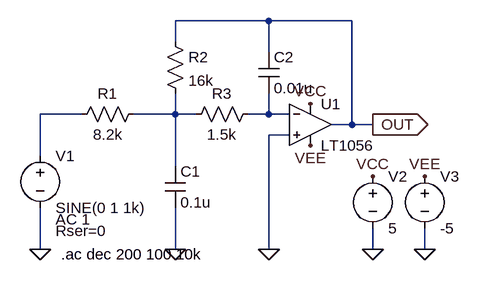
[diagram p0: schematic 2-5_MFB_2nd-Order_LPF.asc]
2-5_MFB_2nd-Order_LPF.asc, the LTspice schematic file:
Version 4.1
SHEET 1 880 680
WIRE 416 -80 272 -80
WIRE 544 -80 416 -80
WIRE 272 -48 272 -80
WIRE 416 -32 416 -80
WIRE 128 64 64 64
WIRE 272 64 272 32
WIRE 272 64 208 64
WIRE 304 64 272 64
WIRE 416 64 416 32
WIRE 416 64 384 64
WIRE 448 64 416 64
WIRE 544 80 544 -80
WIRE 544 80 512 80
WIRE 576 80 544 80
WIRE 448 96 416 96
WIRE 64 128 64 64
WIRE 272 144 272 64
WIRE 64 272 64 208
WIRE 272 272 272 208
WIRE 416 272 416 96
WIRE 576 272 576 240
WIRE 656 272 656 240
FLAG 576 80 OUT
IOPIN 576 80 Out
FLAG 64 272 0
FLAG 272 272 0
FLAG 416 272 0
FLAG 576 272 0
FLAG 656 272 0
FLAG 576 160 VCC
FLAG 480 48 VCC
FLAG 480 112 VEE
FLAG 656 160 VEE
SYMBOL voltage 64 112 R0
WINDOW 123 24 114 Left 2
WINDOW 39 24 132 Left 2
SYMATTR InstName V1
SYMATTR Value SINE(0 1 1k)
SYMATTR Value2 AC 1
SYMATTR SpiceLine Rser=0
SYMBOL res 224 48 R90
WINDOW 0 0 56 VBottom 2
WINDOW 3 32 56 VTop 2
SYMATTR InstName R1
SYMATTR Value 8.2k
SYMBOL cap 256 144 R0
SYMATTR InstName C1
SYMATTR Value 0.1u
SYMBOL res 256 -64 R0
SYMATTR InstName R2
SYMATTR Value 16k
SYMBOL res 400 48 R90
WINDOW 0 0 56 VBottom 2
WINDOW 3 32 56 VTop 2
SYMATTR InstName R3
SYMATTR Value 1.5k
SYMBOL cap 400 -32 R0
SYMATTR InstName C2
SYMATTR Value 0.01u
SYMBOL OpAmps\\LT1056 480 16 R0
SYMATTR InstName U1
SYMBOL voltage 576 144 R0
SYMATTR InstName V2
SYMATTR Value 5
SYMBOL voltage 656 144 R0
SYMATTR InstName V3
SYMATTR Value -5
TEXT 96 280 Left 2 !.ac dec 200 100 10k

The netlist it stands for:
* 2-5_MFB_2nd-Order_LPF.asc
V1 N001 0 SINE(0 1 1k) AC 1 Rser=0
R1 N002 N001 8.2k
C1 N002 0 0.1u
R2 OUT N002 16k
R3 N003 N002 1.5k
C2 OUT N003 0.01u
X§U1 0 N003 VCC VEE OUT LT1056  ; pins In+ In- V+ V- OUT
V2 VCC 0 5
V3 VEE 0 -5
.ac dec 200 100 10k
.backanno
.end